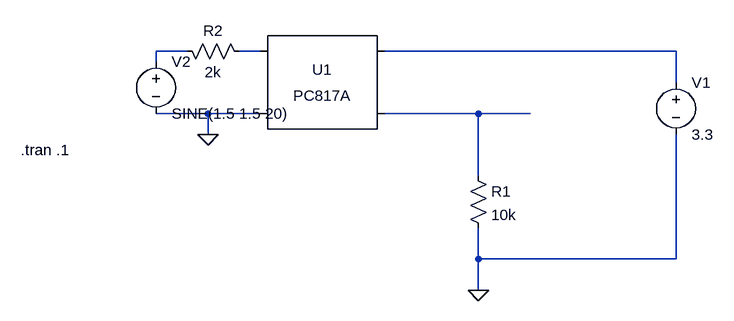
[diagram p0: schematic serial bus.asc]
serial bus.asc, the LTspice schematic file:
Version 4
SHEET 1 880 680
WIRE 16 128 -32 128
WIRE 128 128 96 128
WIRE 768 128 320 128
WIRE -32 144 -32 128
WIRE 768 176 768 128
WIRE 48 224 -32 224
WIRE 128 224 48 224
WIRE 464 224 320 224
WIRE 544 224 464 224
WIRE 48 256 48 224
WIRE 464 320 464 224
WIRE 464 448 464 400
WIRE 768 448 768 256
WIRE 768 448 464 448
WIRE 464 496 464 448
FLAG 48 256 0
FLAG 464 496 0
SYMBOL Optos\\PC817A 224 176 R0
SYMATTR InstName U1
SYMBOL res 448 304 R0
SYMATTR InstName R1
SYMATTR Value 10k
SYMBOL voltage 768 160 R0
WINDOW 123 0 0 Left 0
WINDOW 39 0 0 Left 0
SYMATTR InstName V1
SYMATTR Value 3.3
SYMBOL voltage -32 128 R0
WINDOW 123 0 0 Left 0
WINDOW 39 0 0 Left 0
SYMATTR InstName V2
SYMATTR Value SINE(1.5 1.5 20)
SYMBOL res 0 112 M90
WINDOW 0 0 56 VBottom 0
WINDOW 3 32 56 VTop 0
SYMATTR InstName R2
SYMATTR Value 2k
TEXT -240 280 Left 0 !.tran .1

The netlist it stands for:
* serial bus.asc
XU1 N002 0 N003 N004 PC817 Igain=1m
R1 N004 0 10k
V1 N003 0 3.3
V2 N001 0 SINE(1.5 1.5 20)
R2 N001 N002 2k
.tran .1
.lib PC817.sub
.backanno
.end